# EAGLE design switch (EAGLE 5.12)
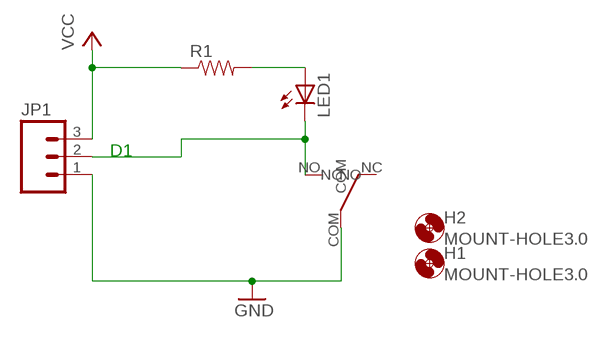
[diagram p0: schematic, sheet 1]

## Parts
H1  MOUNT-HOLE3.0  [3,0]
H2  MOUNT-HOLE3.0  [3,0]
JP1  M03PTH  [1X03]
LED1  LED0603  [0603-LED]
R1  RESISTOR0603  [0603-RC]
U$1  D2F  [D2F]

## Nets
GND: JP1.1 U$1.COM
N$1: LED1.A R1.2
N$4: JP1.2 LED1.C U$1.NO
VCC: JP1.3 R1.1
Unconnected: U$1.NC

## Notes on the sheet
- D1

## Library data of the parts
H1 H2 = holes:MOUNT-HOLE: MOUNTING HOLE with drill center marker
JP1 = SparkFun:M03: Header 3 Standard 3-pin 0.1" header. Use with straight break away headers (SKU : PRT-00116), right angle break away headers (PRT-00553), swiss pins (PRT-00743), machine pins (PRT-00117), and female headers (PRT-00115). Molex polarized connector foot print use with SKU : PRT-08232 with associated crimp pins and housings.
LED1 = Hoektronics:LED: LEDs Standard schematic elements and footprints for 5mm, 3mm, 1206, and 0603 sized LEDs. 5mm - Spark Fun Electronics SKU : COM-00529 (and others)
R1 = Hoektronics:RESISTOR: Resistor Basic schematic elements and footprints for 0603, 1206, and PTH 1/10th watt (small) resistors.
U$1 = Hoektronics:D2F

## Net classes
0 default: clearance 0.305 mm

## Board
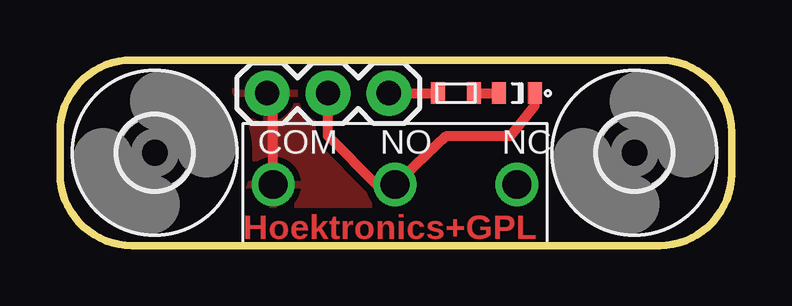
[diagram p1: board, top side]
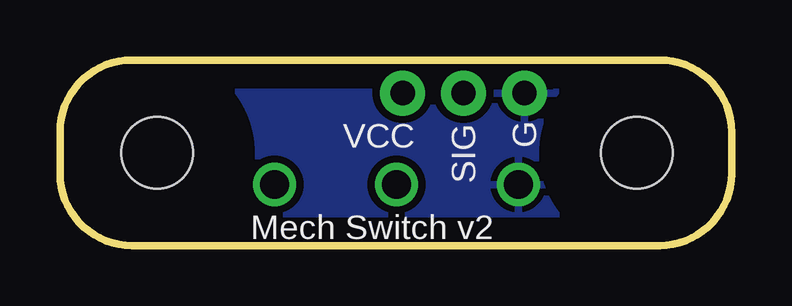
[diagram p2: board, bottom side, seen from below]

Size 28 x 7.73 mm. Coordinates in mm from the lower left corner, seen from the top.
Outline: 3,7.73 arc90 0,4.73 0,3 arc90 3,0 25,0 arc90 28,3 28,4.73 arc90 25,7.73 3,7.73
Copper layers (1*16): Top 0.035mm / dielectric 1.5mm / Bottom 0.035mm
Design rules "default": minimum track width 10mil, minimum drill 24mil, track to track 8mil, track to pad 8mil, pad to pad 8mil, via to via 8mil, smd to smd 8mil, copper to edge 40mil, drill to drill 8mil, minimum pad ring 10mil, minimum via ring 8mil, stop-mask expansion 4mil, vias tented up to drill 0mil, thermal gap 10mil

### Footprints (pad centres in the part's own frame; a part is rotated, then mirrored left to right if it is on the bottom)
3,0 = hole 3: 0,0
1X03 = drill 1.016 pad 1.88 round: 1 0,0; 2 2.54,0; 3 5.08,0
0603-LED = smd 0.6 x 0.9: A 0.75,0; C -0.75,0
0603-RC = smd 0.6 x 0.9: 1 -0.75,0; 2 0.75,0
D2F = drill 1.2 round: COM -5.08,0; NC 5.08,0; NO 0,0

### Placement (x,y rotation side)
H1  23.95,3.87 0 top
H2  3.95,3.87 0 top
JP1  8.64,6.35 0 top
LED1  19.05,6.35 180 top
R1  16.51,6.35 0 top
U$1  13.97,2.54 0 top

### Tracks (layer width: path | path; a pad name or v marks a point on that pad's centre or on a via)
GND
  Top 0.406: U$1.COM 8.89,6.1 JP1.1
  pour Top: 0,7.87 28.19,7.87 28.19,-0.51 0,-0.51
  pour Bottom: 0,7.87 28.19,7.87 28.19,-0.51 0,-0.51
N$1
  Top 0.406: R1.2 LED1.A
N$4
  Top 0.406: LED1.C 19.8,5.83 18.8,4.57 16.12,4.57 U$1.NO 13.21,2.54 11.18,4.57 JP1.2
VCC
  Top 0.406: JP1.3 R1.1

### Text on the board
Top: Hoektronics+GPL
bPlace: G | SIG | VCC | Mech Switch v2